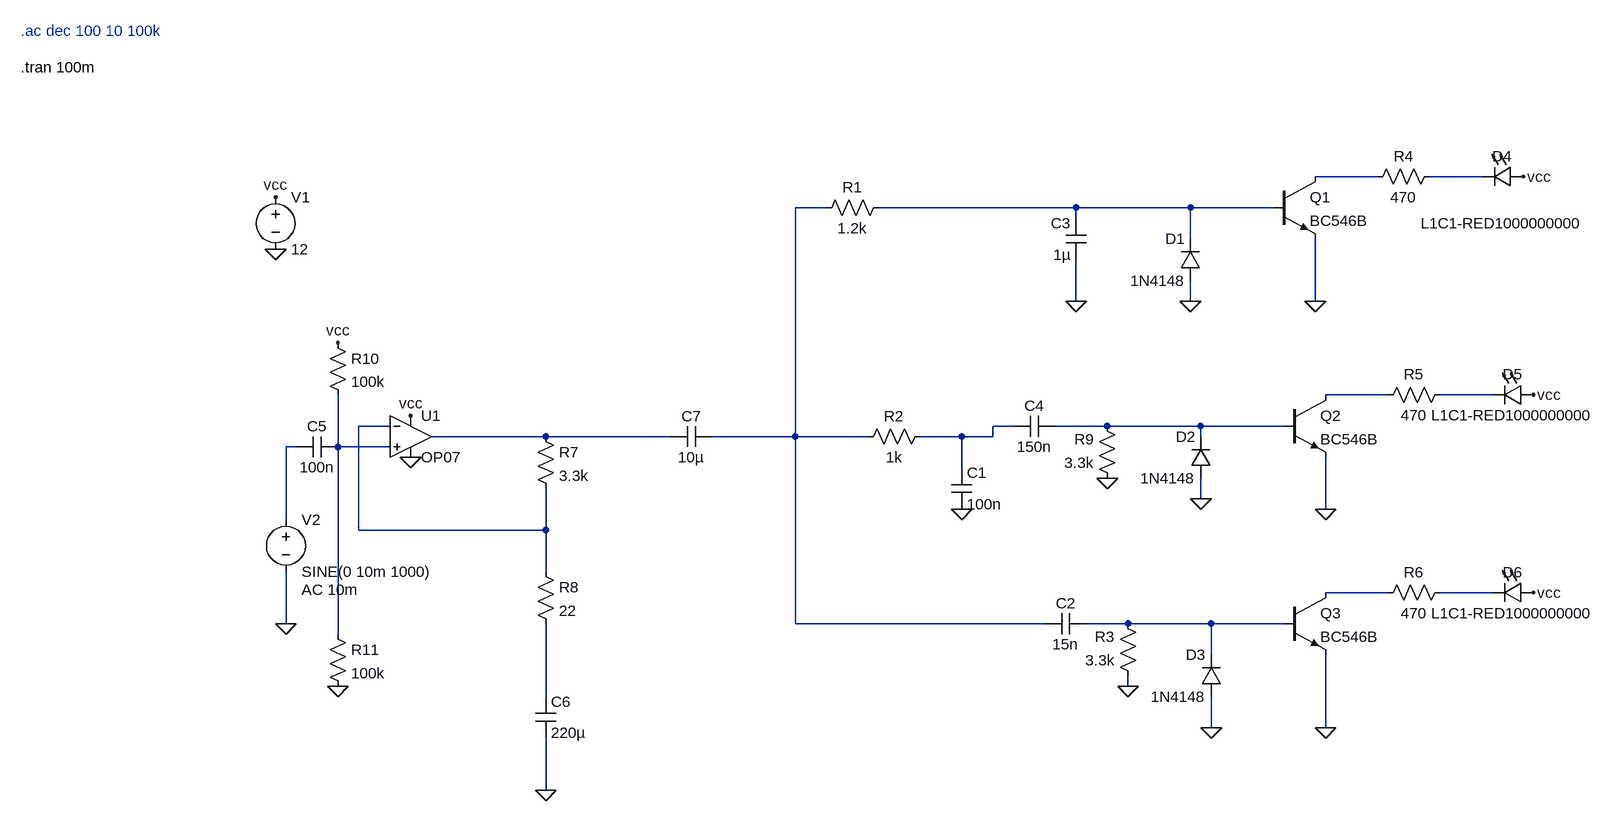
[diagram p0: schematic kolorofon.asc]
kolorofon.asc, the LTspice schematic file:
Version 4
SHEET 1 1656 952
WIRE 864 -144 768 -144
WIRE 1024 -144 944 -144
WIRE 16 -96 -32 -96
WIRE 400 -96 96 -96
WIRE 576 -96 400 -96
WIRE 704 -96 576 -96
WIRE 400 -80 400 -96
WIRE 576 -48 576 -96
WIRE 400 48 400 -16
WIRE 576 48 576 16
WIRE 768 48 768 -48
WIRE 880 192 784 192
WIRE 1040 192 960 192
WIRE -656 240 -704 240
WIRE 304 240 272 240
WIRE 448 240 368 240
WIRE 592 240 448 240
WIRE 720 240 592 240
WIRE -416 256 -592 256
WIRE -224 256 -416 256
WIRE -32 256 -32 -96
WIRE -32 256 -160 256
WIRE 80 256 -32 256
WIRE 224 256 160 256
WIRE 272 256 272 240
WIRE 272 256 224 256
WIRE 592 256 592 240
WIRE -800 272 -816 272
WIRE -736 272 -736 192
WIRE -656 272 -736 272
WIRE 224 304 224 256
WIRE 592 352 592 320
WIRE 784 368 784 288
WIRE -816 384 -816 272
WIRE -704 400 -704 240
WIRE -416 400 -416 336
WIRE -416 400 -704 400
WIRE -416 464 -416 400
WIRE 880 496 784 496
WIRE 1040 496 960 496
WIRE -816 544 -816 464
WIRE -32 544 -32 256
WIRE 352 544 -32 544
WIRE 480 544 416 544
WIRE 608 544 480 544
WIRE 720 544 608 544
WIRE -736 560 -736 272
WIRE 608 592 608 544
WIRE 480 640 480 624
WIRE -416 656 -416 544
WIRE 608 704 608 656
WIRE 784 704 784 592
WIRE -416 800 -416 720
FLAG 400 48 0
FLAG 576 48 0
FLAG 592 352 0
FLAG 608 704 0
FLAG 768 48 0
FLAG 784 368 0
FLAG 784 704 0
FLAG 1088 -144 vcc
FLAG 1104 192 vcc
FLAG 1104 496 vcc
FLAG -832 -112 vcc
FLAG -832 -32 0
FLAG -416 800 0
FLAG -816 544 0
FLAG -624 288 0
FLAG -624 224 vcc
FLAG 480 640 0
FLAG 224 368 0
FLAG 448 320 0
FLAG -736 640 0
FLAG -736 112 vcc
SYMBOL res 112 -112 R90
WINDOW 0 0 56 VBottom 2
WINDOW 3 32 56 VTop 2
SYMATTR InstName R1
SYMATTR Value 1.2k
SYMBOL res 496 640 R180
WINDOW 0 36 76 Left 2
WINDOW 3 36 40 Left 2
SYMATTR InstName R3
SYMATTR Value 3.3k
SYMBOL cap 416 528 R90
WINDOW 0 0 32 VBottom 2
WINDOW 3 32 32 VTop 2
SYMATTR InstName C2
SYMATTR Value 15n
SYMBOL cap 416 -16 R180
WINDOW 0 24 56 Left 2
WINDOW 3 24 8 Left 2
SYMATTR InstName C3
SYMATTR Value 1µ
SYMBOL diode 608 320 R180
WINDOW 0 24 64 Left 2
WINDOW 3 24 0 Left 2
SYMATTR InstName D2
SYMATTR Value 1N4148
SYMBOL diode 592 16 R180
WINDOW 0 24 64 Left 2
WINDOW 3 24 0 Left 2
SYMATTR InstName D1
SYMATTR Value 1N4148
SYMBOL diode 624 656 R180
WINDOW 0 24 64 Left 2
WINDOW 3 24 0 Left 2
SYMATTR InstName D3
SYMATTR Value 1N4148
SYMBOL npn 704 -144 R0
SYMATTR InstName Q1
SYMATTR Value BC546B
SYMBOL npn 720 192 R0
SYMATTR InstName Q2
SYMATTR Value BC546B
SYMBOL npn 720 496 R0
SYMATTR InstName Q3
SYMATTR Value BC546B
SYMBOL LED 1088 -160 R90
WINDOW 0 0 32 VBottom 2
WINDOW 3 72 32 VTop 2
SYMATTR InstName D4
SYMATTR Value L1C1-RED1000000000
SYMATTR Description Diode
SYMATTR Type diode
SYMBOL LED 1104 176 R90
WINDOW 0 0 32 VBottom 2
WINDOW 3 32 32 VTop 2
SYMATTR InstName D5
SYMATTR Value L1C1-RED1000000000
SYMATTR Description Diode
SYMATTR Type diode
SYMBOL LED 1104 480 R90
WINDOW 0 0 32 VBottom 2
WINDOW 3 32 32 VTop 2
SYMATTR InstName D6
SYMATTR Value L1C1-RED1000000000
SYMATTR Description Diode
SYMATTR Type diode
SYMBOL res 960 -160 R90
WINDOW 0 0 56 VBottom 2
WINDOW 3 32 56 VTop 2
SYMATTR InstName R4
SYMATTR Value 470
SYMBOL res 976 176 R90
WINDOW 0 0 56 VBottom 2
WINDOW 3 32 56 VTop 2
SYMATTR InstName R5
SYMATTR Value 470
SYMBOL res 976 480 R90
WINDOW 0 0 56 VBottom 2
WINDOW 3 32 56 VTop 2
SYMATTR InstName R6
SYMATTR Value 470
SYMBOL voltage -832 -128 R0
WINDOW 123 0 0 Left 0
WINDOW 39 0 0 Left 0
SYMATTR InstName V1
SYMATTR Value 12
SYMBOL res -432 240 R0
SYMATTR InstName R7
SYMATTR Value 3.3k
SYMBOL res -432 448 R0
SYMATTR InstName R8
SYMATTR Value 22
SYMBOL cap -432 656 R0
SYMATTR InstName C6
SYMATTR Value 220µ
SYMBOL OpAmps\\OP07 -624 192 R0
SYMATTR InstName U1
SYMBOL voltage -816 368 R0
WINDOW 123 24 124 Left 2
WINDOW 39 0 0 Left 0
SYMATTR Value2 AC 10m
SYMATTR InstName V2
SYMATTR Value SINE(0 10m 1000)
SYMBOL res 176 240 R90
WINDOW 0 0 56 VBottom 2
WINDOW 3 32 56 VTop 2
SYMATTR InstName R2
SYMATTR Value 1k
SYMBOL res 464 336 R180
WINDOW 0 36 76 Left 2
WINDOW 3 36 40 Left 2
SYMATTR InstName R9
SYMATTR Value 3.3k
SYMBOL cap 208 304 R0
SYMATTR InstName C1
SYMATTR Value 100n
SYMBOL cap 368 224 R90
WINDOW 0 0 32 VBottom 2
WINDOW 3 32 32 VTop 2
SYMATTR InstName C4
SYMATTR Value 150n
SYMBOL cap -736 256 R90
WINDOW 0 0 32 VBottom 2
WINDOW 3 32 32 VTop 2
SYMATTR InstName C5
SYMATTR Value 100n
SYMBOL cap -160 240 R90
WINDOW 0 0 32 VBottom 2
WINDOW 3 32 32 VTop 2
SYMATTR InstName C7
SYMATTR Value 10µ
SYMBOL res -752 96 R0
SYMATTR InstName R10
SYMATTR Value 100k
SYMBOL res -752 544 R0
SYMATTR InstName R11
SYMATTR Value 100k
TEXT -1224 -368 Left 2 ;.ac dec 100 10 100k
TEXT -1224 -312 Left 2 !.tran 100m

The netlist it stands for:
* kolorofon.asc
R1 N004 N003 1.2k
R3 0 N015 3.3k
C2 N015 N003 15n
C3 0 N004 1µ
D2 0 N009 1N4148
D1 0 N004 1N4148
D3 0 N015 1N4148
Q1 N001 N004 0 0 BC546B
Q2 N005 N009 0 0 BC546B
Q3 N013 N015 0 0 BC546B
D4 vcc N002 L1C1-RED1000000000
D5 vcc N006 L1C1-RED1000000000
D6 vcc N014 L1C1-RED1000000000
R4 N002 N001 470
R5 N006 N005 470
R6 N014 N013 470
V1 vcc 0 12
R7 N010 N007 3.3k
R8 N007 N016 22
C6 N016 0 220µ
XU1 N012 N007 vcc 0 N010 LT1001  ; OP07, pins In+ In- V+ V- OUT
V2 N011 0 SINE(0 10m 1000) AC 10m
R2 N008 N003 1k
R9 0 N009 3.3k
C1 N008 0 100n
C4 N009 N008 150n
C5 N012 N011 100n
C7 N003 N010 10µ
R10 vcc N012 100k
R11 N012 0 100k
.model D D
.lib standard.dio
.model NPN NPN
.model PNP PNP
.lib standard.bjt
* .ac dec 100 10 100k
.tran 100m
.lib LTC.lib
.backanno
.end